# Altium schematic sheet alim_MOSFET 1.SchDoc
size A4; SheetNumber: 4; SheetTotal: 7
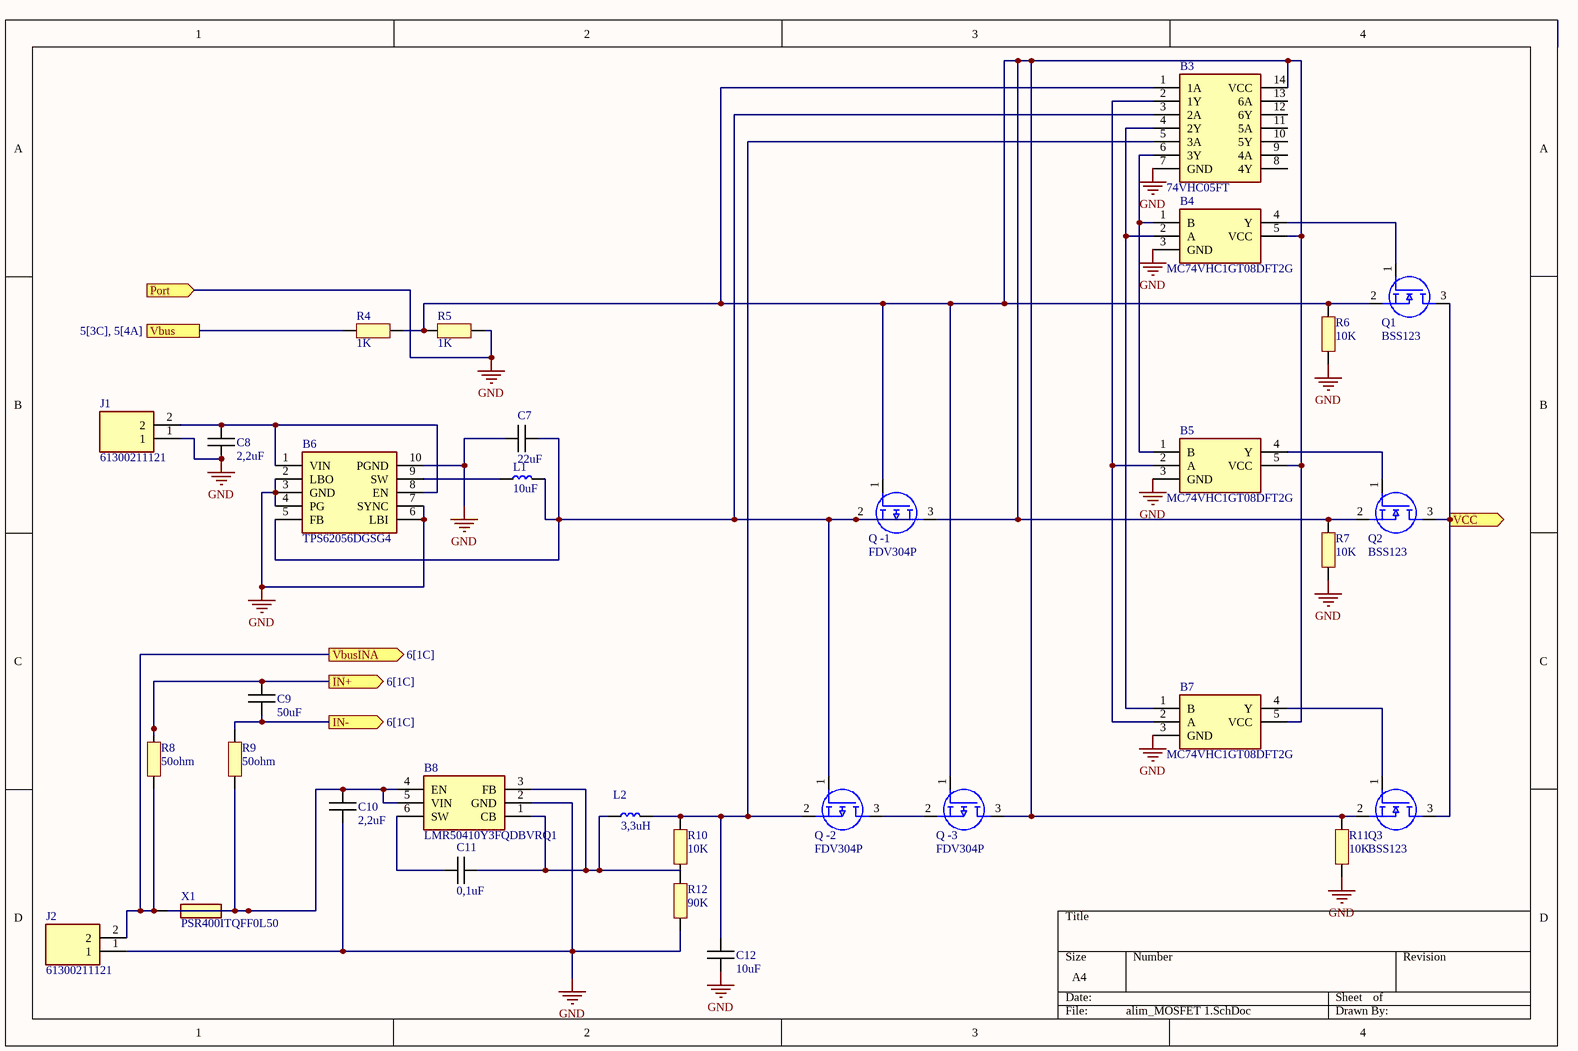
[diagram p0: alim_MOSFET 1.SchDoc]

## Parts
B3  74VHC05FT  [SOP65P640X120-14N]
B4  MC74VHC1GT08DFT2G  [SOT65P210X110-5N]
B5  MC74VHC1GT08DFT2G  [SOT65P210X110-5N]
B6  TPS62056DGSG4  [SOP50P490X110-10N]
B7  MC74VHC1GT08DFT2G  [SOT65P210X110-5N]
B8  LMR50410Y3FQDBVRQ1  [SOT95P280X145-6N]
C7  22uF  [CAPC1005X06N]
C8  2,2uF  [CAPC1005X06N]
C9  50uF  [CAPC1005X06N]
C10  2,2uF  [CAPC1005X06N]
C11  0,1uF  [CAPC1005X06N]
C12  10uF  [CAPC1005X06N]
J1  61300211121  [61300211121]
J2  61300211121  [61300211121]
L1  10uF  [LQPC1005X06N]
L2  3,3uH  [LQPC1005X06N]
Q1  BSS123  [BSS123]
Q2  BSS123  [BSS123]
Q3  BSS123  [BSS123]
Q_-1  FDV304P  [SOT95P251X112-3N]
Q_-2  FDV304P  [SOT95P251X112-3N]
Q_-3  FDV304P  [SOT95P251X112-3N]
R4  1K  [RESC1005X06N]
R5  1K  [RESC1005X06N]
R6  10K  [RESC1005X06N]
R7  10K  [RESC1005X06N]
R8  50ohm  [RESC1005X06N]
R9  50ohm  [RESC1005X06N]
R10  10K  [RESC1005X06N]
R11  10K  [RESC1005X06N]
R12  90K  [RESC1005X06N]
X1  PSR400ITQFF0L50  [RESC10052X200N]

## Ports
IN+ (out, see 6[1C]), IN- (out, see 6[1C]), Port (in), Vbus (see 5[3C], 5[4A]), VbusINA (out, see 6[1C]), VCC (out)

## Nets
GND: B3.7(GND) B4.3(GND) B5.3(GND) B6.2(LBO) B6.3(GND) B6.4(PG) B6.6(LBI) B6.7(SYNC) B6.10(PGND) B7.3(GND) B8.2(GND) C7.2 C8.2 C10.2 C12.2 J1.1 J2.1 R5.2 R6.2 R7.2 R11.2 R12.2 ; port Port
IN+: C9.1 R8.2 ; port IN+
IN-: C9.2 R9.2 ; port IN-
Vbus: R4.1 ; port Vbus
VbusINA: J2.2 R8.1 X1.1 ; port VbusINA
VCC: Q1.3(D) Q2.3(D) Q3.3(D) ; port VCC
NetB3_1: B3.1(1A) B3.14(VCC) B4.5(VCC) B5.5(VCC) B7.5(VCC) Q1.2(S) Q2.2(S) Q3.2(S) Q_-1.1(G) Q_-1.3(D) Q_-3.1(G) Q_-3.3(D) R4.2 R5.1 R6.1 R7.1 R11.1
NetB3_2: B3.2(1Y) B5.2(A) B7.2(A)
NetB3_3: B3.3(2A) B6.5(FB) C7.1 L1.2 Q_-1.2(S) Q_-2.1(G)
NetB3_4: B3.4(2Y) B4.2(A) B7.1(B)
NetB3_5: B3.5(3A) C12.1 L2.2 Q_-2.2(S) R10.1
NetB3_6: B3.6(3Y) B4.1(B) B5.1(B)
NetB4_4: B4.4(Y) Q1.1(G)
NetB5_4: B5.4(Y) Q2.1(G)
NetB6_1: B6.1(VIN) B6.8(EN) C8.1 J1.2
NetB6_9: B6.9(SW) L1.1
NetB7_4: B7.4(Y) Q3.1(G)
NetB8_1: B8.1(CB) B8.3(FB) C11.1 L2.1 R12.1
NetB8_4: B8.4(EN) B8.5(VIN) C10.1 R9.1 X1.2
NetB8_6: B8.6(SW) C11.2
NetQ_-2_3: Q_-2.3(D) Q_-3.2(S)

Not connected (* = marked no-connect by the designer): B3 8(4Y) 9(4A) 10(5Y) 11(5A) 12(6Y) 13(6A); R10 2

## Library data of the parts
B3 = 74VHC05FT: Logic Gates CMOS LOGIC IC INVERTER; Manufacturer_Name: Toshiba; Manufacturer_Part_Number: 74VHC05FT; Mouser Part Number: 757-74VHC05FT
B4 B5 B7 = MC74VHC1GT08DFT2G: Single 2-Input AND Gate, TTL Level; Manufacturer_Name: onsemi; Manufacturer_Part_Number: MC74VHC1GT08DFT2G; Parameter 3: *
B6 = TPS62056DGSG4: TEXAS INSTRUMENTS - TPS62056DGSG4 - Synchronous Buck (Step Down) Switching Regulator, Fixed, 2.7V-10Vin, 3.3V/0.8A out, 850kHz, VSSOP-10; Manufacturer_Name: Texas Instruments; Manufacturer_Part_Number: TPS62056DGSG4; Mouser Part Number: 595-TPS62056DGSG4
B8 = LMR50410Y3FQDBVRQ1: Régulateurs de tension de commutation Automotive qualified SIMPLE SWITCHER 4-V to 36-V, 1-A synchronous step-down converter 6-SOT-23 -40 to 150; Manufacturer_Name: Texas Instruments; Manufacturer_Part_Number: LMR50410Y3FQDBVRQ1; Mouser Part Number: 595-R50410Y3FQDBVRQ1
C7-C12 = Capacitor
J1 J2 = 61300211121: WURTH ELEKTRONIK - 61300211121 - HEADER, 2.54MM, PIN, THT, VERTICAL, 2WAY
L1 L2 = Bobine
Q1-Q3 = BSS123: BSS123 N-Channel MOSFET, 170 mA, 100 V PowerTrench, 3-Pin SOT-23 ON Semiconductor
Q_-1-Q_-3 = FDV304P: ON SEMICONDUCTOR - FDV304P - Power MOSFET, P Channel, 25 V, 460 mA, 1.22 ohm, SOT-23, Surface Mount; Manufacturer_Name: onsemi; Geometry.Height: 1.12mm; Manufacturer_Part_Number: FDV304P; Mouser Part Number: 512-FDV304P; Mouser Price/Stock: https://www.mouser.co.uk/ProductDetail/onsemi-Fairchild/FDV304P?qs=FOlmdCx%252BAA1BAlCQZu888w%3D%3D; Arrow Part Number: FDV304P; Arrow Price/Stock: https://www.arrow.com/en/products/fdv304p/on-semiconductor?utm_currency=USD&region=europe; Datasheet Link: https://componentsearchengine.com/Datasheets/2/FDV304P.pdf
R4-R12 = Resistor
X1 = PSR400ITQFF0L50: ROHM - PSR400ITQFF0L50 - SMD Current Sense Resistor, 500 ohm, PSR Series, 3921 [1052 Metric], 4 W, +/- 1%, Metal Strip; Manufacturer_Name: ROHM Semiconductor; Geometry.Height: 2mm; Manufacturer_Part_Number: PSR400ITQFF0L50; Mouser Part Number: 755-PSR400ITQFF0L50; Mouser Price/Stock: https://www.mouser.co.uk/ProductDetail/ROHM-Semiconductor/PSR400ITQFF0L50?qs=493kPxzlxfLaT1w5Mo%252BtHg%3D%3D; Arrow Part Number: *; Arrow Price/Stock: *; Datasheet Link: https://componentsearchengine.com/Datasheets/2/PSR400ITQFF0L50.pdf